# EAGLE design Cutman-RevA (EAGLE 6.5.0)
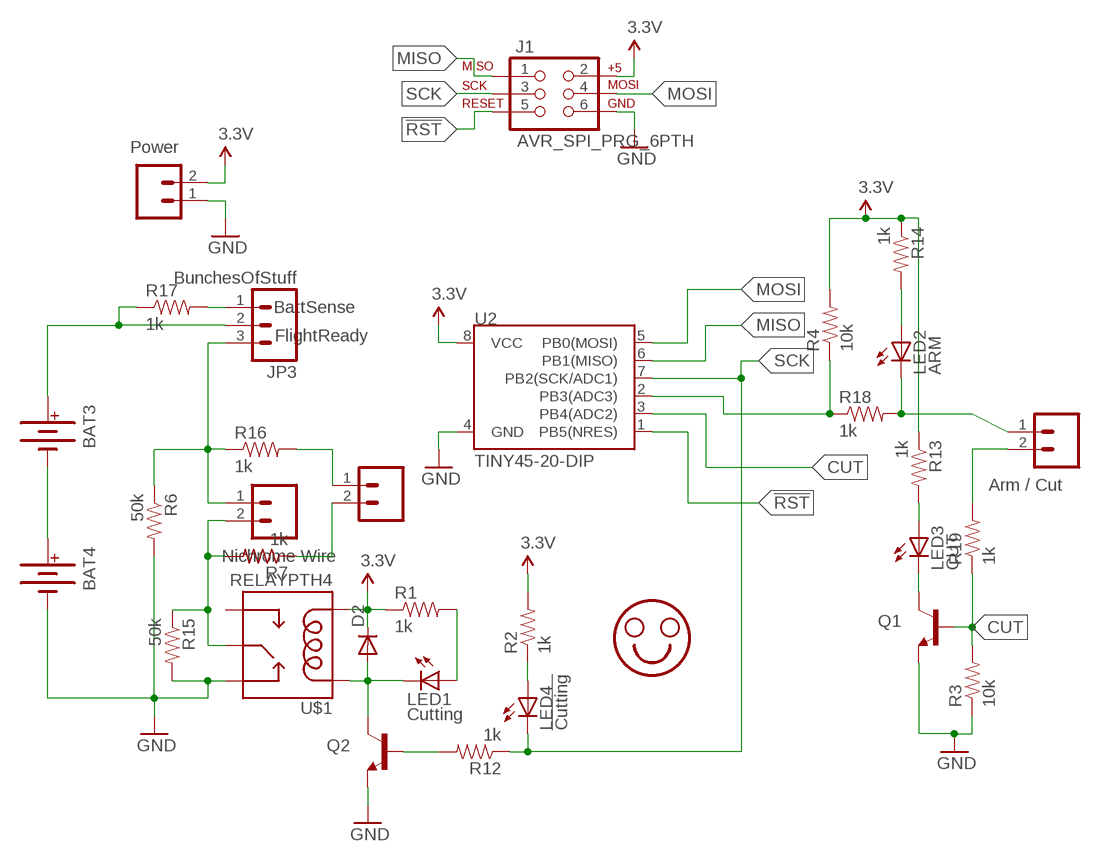
[diagram p0: schematic, sheet 1]

## Parts
BAT3  BATTERYAA-KIT  [BATTERY-AA-KIT]
BAT4  BATTERYAA-KIT  [BATTERY-AA-KIT]
D2  DIODEPTH  [DIODE-1N4001]
J1  AVR_SPI_PRG_6PTH  [2X3]
JP1  NichromeWire  M023.5MM_LOCK  [SCREWTERMINAL-3.5MM-2_LOCK]
JP2  Power  M023.5MM_LOCK  [SCREWTERMINAL-3.5MM-2_LOCK]
JP3  BunchesOfStuff  M03SCREW  [SCREWTERMINAL-3.5MM-3]
JP4  VSense  M023.5MM_LOCK  [SCREWTERMINAL-3.5MM-2_LOCK]
JP6  Arm/Cut  M023.5MM_LOCK  [SCREWTERMINAL-3.5MM-2_LOCK]
LED1  Cutting  LED5MM  [LED5MM]
LED2  ARM  LED5MM  [LED5MM]
LED3  CUT  LED5MM  [LED5MM]
LED4  !Cutting  LED5MM  [LED5MM]
Q1  TRANSISTOR_NPNTO92  [TO-92]
Q2  TRANSISTOR_NPNTO92  [TO-92]
R1  1k  RESISTORAXIAL-0.3  [AXIAL-0.3]
R2  1k  RESISTORAXIAL-0.3  [AXIAL-0.3]
R3  10k  RESISTORAXIAL-0.3  [AXIAL-0.3]
R4  10k  RESISTORAXIAL-0.3  [AXIAL-0.3]
R6  50k  RESISTORAXIAL-0.3  [AXIAL-0.3]
R7  1k  R-US_0309/V  [0309V]
R12  1k  RESISTORAXIAL-0.3  [AXIAL-0.3]
R13  1k  RESISTORAXIAL-0.3  [AXIAL-0.3]
R14  1k  RESISTORAXIAL-0.3  [AXIAL-0.3]
R15  50k  RESISTORAXIAL-0.3  [AXIAL-0.3]
R16  1k  RESISTORAXIAL-0.3  [AXIAL-0.3]
R17  1k  RESISTORAXIAL-0.3  [AXIAL-0.3]
R18  1k  RESISTORAXIAL-0.3  [AXIAL-0.3]
R19  1k  RESISTORAXIAL-0.3  [AXIAL-0.3]
STANDOFF1  STAND-OFF  [STAND-OFF]
STANDOFF2  STAND-OFF  [STAND-OFF]
U2  TINY45-20-DIP  ATTINY45TINY45-20-DIP  [DIP08]
U$1  RELAYPTH4  [RELAY-JZC]

## Nets
3.3V: D2.C J1.2 JP2.2 R1.P$1 R2.P$2 R4.P$2 R13.P$1 R14.P$1 U2.8(VCC) U$1.1(COIL2)
!RST: J1.5 U2.1(PB5(NRES))
ARM: R4.P$1 R18.P$1 U2.2(PB3(ADC3))
CUT: Q1.2(B) R3.P$2 R19.P$1 U2.3(PB4(ADC2))
GND: BAT4.GND@1(-) BAT4.GND@2(-) J1.6 JP2.1 Q1.1(E) Q2.1(E) R3.P$1 R6.P$2 R15.P$2 U2.4(GND) U$1.2(NC)
MISO: J1.1 U2.6(PB1(MISO))
MOSI: J1.4 U2.5(PB0(MOSI))
N$1: JP1.1 JP3.3 R6.P$1 R16.P$1
N$2: JP1.2 R7.2 R15.P$1 U$1.4(MAIN)
N$3: LED1.A R1.P$2
N$4: JP3.1 R17.P$2
N$5: BAT3.PWR@1(+) BAT3.PWR@2(+) JP3.2 R17.P$1
N$6: LED4.A R2.P$1
N$7: LED2.A R14.P$2
N$8: JP4.1 R16.P$2
N$9: JP6.1 LED2.K(C) R18.P$2
N$10: JP6.2 R19.P$2
N$11: BAT3.GND@1(-) BAT3.GND@2(-) BAT4.PWR@1(+) BAT4.PWR@2(+)
N$12: D2.A LED1.K(C) Q2.3(C) U$1.5(COIL1)
N$13: JP4.2 R7.1
N$14: LED3.K(C) Q1.3(C)
N$15: Q2.2(B) R12.P$2
N$16: LED3.A R13.P$2
SCK: J1.3 LED4.K(C) R12.P$1 U2.7(PB2(SCK/ADC1))
Unconnected: U$1.3(NO)

## Notes on the sheet
- Power
- BattSense
- FlightReady
- Arm / Cut
- Nichrome Wire

## Library data of the parts
BAT3 BAT4 = SparkFun-Electromechanical:BATTERY: Battery Holders Various common sizes : AA, AAA, 20mm coin cell and 12mm coin cell. 20MM_4LEGS, BATT-10373; PROD_ID: BATT-08316
D2 = SparkFun-DiscreteSemi:DIODE: Diode These are standard reverse protection diodes and small signal diodes. SMA package can handle up to about 1A. SOD-323 can handle about 200mA. What the SOD-323 package when ordering, there are some mfgs out there that are 5-pin packages.
J1 = SparkFun-Connectors:AVR_SPI_PRG_6: AVR ISP 6 Pin This is the reduced ISP connector for AVR programming. Common on Arduino. This footprint will take up less PCB space and can be used with a 10-pin to 6-pin adapter such as SKU: BOB-08508
JP1 JP2 JP4 JP6 = SparkFun-Connectors:M02: Standard 2-pin 0.1" header. Use with - straight break away headers ( PRT-00116) - right angle break away headers (PRT-00553) - swiss pins (PRT-00743) - machine pins (PRT-00117) - female headers (PRT-00115) Molex polarized connector foot print use with: PRT-08233 with associated crimp pins and housings. 2.54_SCREWTERM for use with PRT-10571. 3.5mm Screw Terminal footprints for PRT-08084 5mm Screw Terminal footprints for use with PRT-08433
JP3 = SparkFun-Connectors:M03: Header 3 Standard 3-pin 0.1" header. Use with straight break away headers (SKU : PRT-00116), right angle break away headers (PRT-00553), swiss pins (PRT-00743), machine pins (PRT-00117), and female headers (PRT-00115). Molex polarized connector foot print use with SKU : PRT-08232 with associated crimp pins and housings.
LED1-LED4 = adafruit:LED: LED OSRAM: - CHIPLED LG R971, LG N971, LY N971, LG Q971, LY Q971, LO R971, LY R971 LH N974, LH R974 LS Q976, LO Q976, LY Q976 LO Q996 - Hyper CHIPLED LW Q18S LB Q993, LB Q99A, LB R99A - SideLED LS A670, LO A670, LY A670, LG A670, LP A670 LB A673, LV A673, LT A673, LW A673 LH A674 LY A675 LS A676, LA A676, LO A676, LY A676, LW A676 LS A679, LY A679, LG A679 - Hyper Micro SIDELED® LS Y876, LA Y876, LO Y876, LY Y876 LT Y87S - SmartLED LW L88C, LW L88S LB L89C, LB L89S, LG L890 LS L89K, LO L89K, LY L89K LS L896, LA L896, LO L896, LY L896 - TOPLED LS T670, LO T670, LY T670, LG T670, LP T670 LSG T670, LSP T670, LSY T670, LOP T670, LYG T670 LG T671, LOG T671, LSG T671 LB T673, LV T673, LT T673, LW T673 LH T674 LS T676, LA T676, LO T676, LY T676, LB T676, LH T676, LSB T676, LW T676 LB T67C, LV T67C, LT T67C, LS T67K, LO T67K, LY T67K, LW E67C LS E67B, LA E67B, LO E67B, LY E67B, LB E67C, LV E67C, LT E67C LW T67C LS T679, LY T679, LG T679 LS T770, LO T770, LY T770, LG T770, LP T770 LB T773, LV T773, LT T773, LW T773 LH T774 LS E675, LA E675, LY E675, LS T675 LS T776, LA T776, LO T776, LY T776, LB T776 LHGB T686 LT T68C, LB T68C - Hyper Mini TOPLED® LB M676 - Mini TOPLED Santana® LG M470 LS M47K, LO M47K, LY M47K Source: http://www.osram.convergy.de/
Q1 Q2 = SparkFun-DiscreteSemi:TRANSISTOR_NPN: Generic NPN BJT MMBT2222A - TRANS-08049 (SOT-23, 1A 40V) MPSA42 - TRANS-09116 (SOT-23, 500mA 300V) MMBT5088LT1G - TRANS-11160 (SOT-23, 50 mA 30V)
R1-R4 R6 R12-R19 = SparkFun-Passives:RESISTOR: Resistor Basic schematic elements and footprints for 0603, 1206, and PTH resistors.
R7 = resistor:R-US_: RESISTOR, American symbol
STANDOFF1 STANDOFF2 = SparkFun-Electromechanical:STAND-OFF: #4 Stand Off This is the mechanical footprint for a #4 phillips button head screw. Use the keepout ring to avoid running the screw head into surrounding components. SKU : PRT-00447
U2 = SparkFun-DigitalIC:ATTINY45: Atmel 8-pin 2/4/8kB flash uC; PROD_ID: IC-09439
U$1 = SparkFun-Electromechanical:RELAY: SPDT relay (COM-00101)

## Net classes
1 vcc: width 0.254 mm, drill 0.254 mm, clearance 0.254 mm

## Board
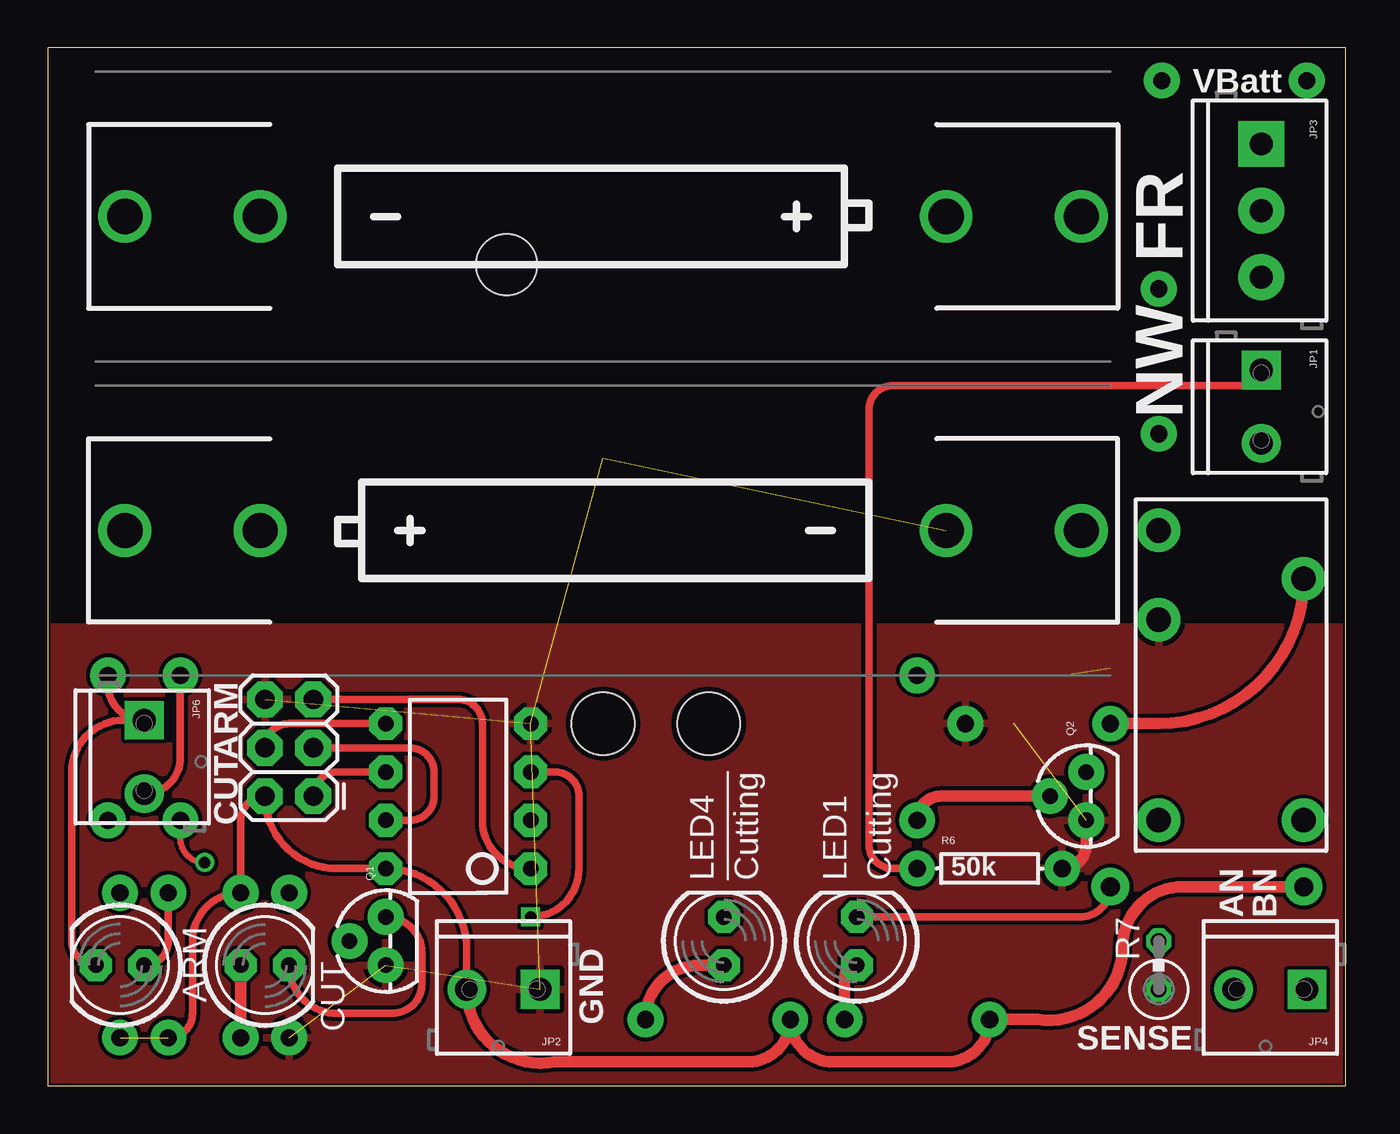
[diagram p1: board, top side]
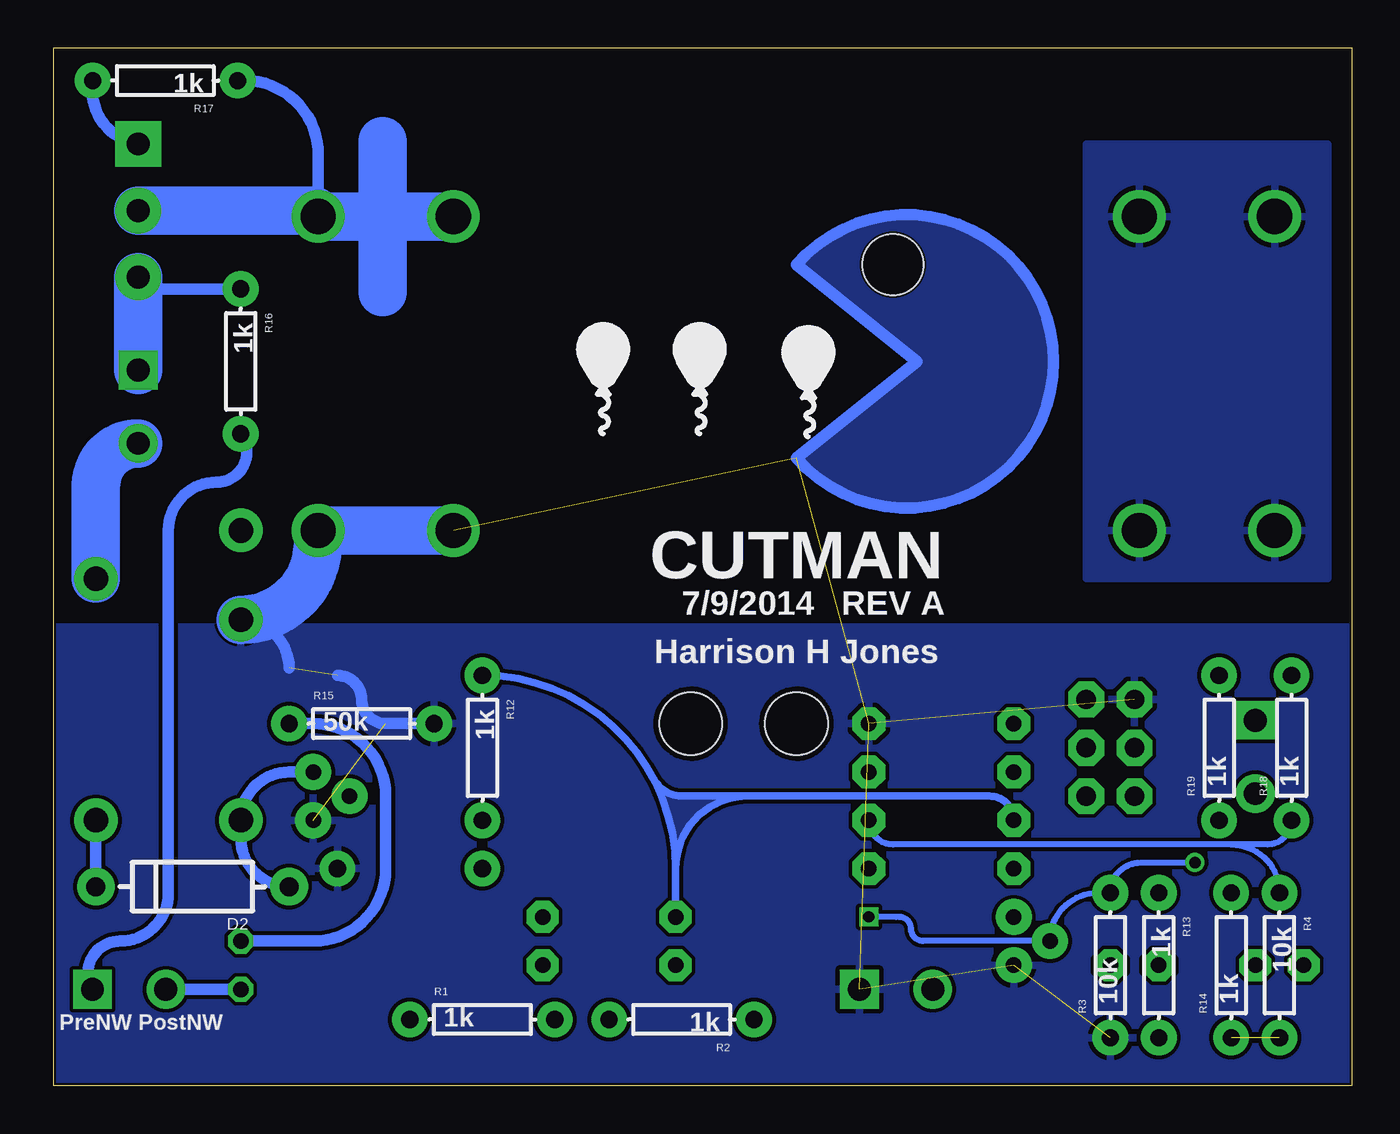
[diagram p2: board, bottom side, seen from below]

Size 68.25 x 54.6 mm. Coordinates in mm from the lower left corner, seen from the top.
Outline: 0,0 68.25,0 68.25,54.6 0,54.6 0,0
Copper layers (1*16): Top 0.035mm / dielectric 1.5mm / Bottom 0.035mm
Design rules "default *": minimum track width 10mil, minimum drill 0.6mm, track to track 8mil, track to pad 8mil, pad to pad 8mil, via to via 8mil, smd to smd 8mil, copper to edge 5mil, drill to drill 8mil, minimum pad ring 10mil, minimum via ring 8mil, stop-mask expansion 4mil, vias tented up to drill 0mil, thermal gap 10mil
Holes 3.2 mm at 24.13,43.18
bRestrict: area 22.9,41.9 to 25.4,44.5

### Footprints (pad centres in the part's own frame; a part is rotated, then mirrored left to right if it is on the bottom)
BATTERY-AA-KIT = drill 1.854: GND@1 25.146,0; GND@2 18.034,0; PWR@1 -25.146,0; PWR@2 -18.034,0
DIODE-1N4001 = drill 1 pad 1.981: A -5.08,0; C 5.08,0
2X3 = drill 1.016 pad 1.88 octagon: 1 0,0; 2 0,2.54; 3 2.54,0; 4 2.54,2.54; 5 5.08,0; 6 5.08,2.54
SCREWTERMINAL-3.5MM-2_LOCK = drill 1.2 pad 2.032 square: 1 -0.178,0 | drill 1.2 pad 2.032: 2 3.678,0
SCREWTERMINAL-3.5MM-3 = drill 1.2 pad 2.413 square: 1 0,0 | drill 1.2 pad 2.413: 2 3.5,0; 3 7,0
LED5MM = drill 0.813 pad 1.676 octagon: A -1.27,0; K 1.27,0
TO-92 = drill 0.813 pad 1.88: 1 -1.27,0; 2 0,1.905; 3 1.27,0
AXIAL-0.3 = drill 0.9 pad 1.88: P$1 -3.81,0; P$2 3.81,0
0309V = drill 0.813 octagon: 1 -1.27,0; 2 1.27,0
STAND-OFF = hole 3.302: 0,0
DIP08 = drill 0.813 pad 1.727 octagon: 1 -3.81,-3.81; 2 -1.27,-3.81; 3 1.27,-3.81; 4 3.81,-3.81; 5 3.81,3.81; 6 1.27,3.81; 7 -1.27,3.81; 8 -3.81,3.81
RELAY-JZC = drill 1.3 pad 2.286: 1 3.81,-8.89; 2 -3.81,1.651; 3 -3.81,6.35; 4 3.81,3.81; 5 -3.81,-8.89

### Placement (x,y rotation side)
BAT3  29.21,45.72 180 top
BAT4  29.21,29.21 0 top
D2  60.96,10.48 180 bottom
J1  13.97,15.24 90 top
JP1  63.82,37.47 270 top
JP2  25.72,5.08 180 top
JP3  63.82,49.53 270 top
JP4  66.04,5.08 180 top
JP6  5.08,19.05 270 top
LED1  42.55,7.62 90 top
LED2  3.81,6.35 180 top
LED3  11.43,6.35 0 top
LED4  35.56,7.62 90 top
Q1  17.78,7.62 90 top
Q2  54.61,15.24 90 top
R1  45.72,3.49 0 bottom
R2  35.24,3.49 180 bottom
R3  12.7,6.35 90 bottom
R4  3.81,6.35 270 bottom
R6  49.53,11.43 0 top
R7  58.42,6.35 90 top
R12  45.72,17.78 270 bottom
R13  10.16,6.35 270 bottom
R14  6.35,6.35 90 bottom
R15  52.07,19.05 0 bottom
R16  58.42,38.1 270 bottom
R17  62.39,52.86 180 bottom
R18  3.17,17.78 90 bottom
R19  6.99,17.78 90 bottom
STANDOFF1  29.21,19.05 0 top
STANDOFF2  34.77,19.05 0 top
U2  21.59,15.24 90 top
U$1  62.23,22.86 0 top

### Tracks (layer width: path | path; a pad name or v marks a point on that pad's centre or on a via)
3.3V  (1 unrouted)
  Top 0.406: R14.P$1 arc90 7.62,3.81 7.62,5.08 7.62,7.62 arc-90 R13.P$1 10.16,13.97 arc-90 J1.2 arc90 15.24,11.43 U2.8 arc-90 22.04,7.17 JP2.2
  Top 0.61: D2.C 59.69,10.48 arc90 56.52,7.3 arc-99 52.07,3.49 R1.P$1 arc-90 47.31,1.27 41.91,1.27 41.27,1.27 arc-90 R2.P$2 arc-90 36.83,1.27 26.67,1.27 arc-101 JP2.2
  Bottom 0.61: U$1.1 D2.C
!RST
  Top 0.406: J1.5 21.59,20.32 arc-90 22.86,19.05 22.86,13.97 arc90 U2.1
ARM
  Bottom 0.305: 6.35,12.7 24.13,12.7 arc90 U2.2 | 6.35,12.7 arc90 R4.P$1 | R18.P$1 arc90 4.45,12.7 6.35,12.7
CUT  (via drill 0.6)
  Top 0.305: v8.26,11.75 arc-90 6.99,13.02 R19.P$1
  Top 0.406: U2.3 26.67,16.51 arc-90 27.94,15.24 27.94,11.43 arc-90 v25.4,8.89
  Bottom 0.305: v25.4,8.89 23.97,8.89 23.81,8.89 arc90 23.18,8.26 arc-90 22.54,7.62 Q1.2 arc90 13.34,10.16 R3.P$2 arc90 11.11,11.75 v8.26,11.75
GND  (8 unrouted)
  Top 0.61: R6.P$2 arc90 54.61,12.7 Q2.1
  Bottom 0.61: 55.88,21.97 arc-90 U$1.2 | 53.34,21.59 arc90 52.07,20.32 arc-90 50.8,19.05 R15.P$2 | 29.21,43.18 22.86,38.1 29.21,33.02 arc-278 29.21,43.18
  Bottom 2.54: U$1.2 arc-90 54.36,28.57 BAT4.GND@1 BAT4.GND@2
  pour Top: -1.27,24.13 71.12,24.13 71.12,-1.27 -1.27,-1.27
  pour Bottom: -2.54,24.13 69.85,24.13 69.85,-1.27 -2.54,-1.27
  pour Bottom: 22.86,38.1 29.21,33.02 25.72,30.8 21.27,30.8 18.1,32.7 16.19,36.2 15.88,38.1 16.51,41.27 18.41,43.81 21.27,45.4 24.13,45.72 26.67,45.09 29.21,43.18
MISO
  Top 0.406: U2.6 15.24,16.51 arc90 J1.1
MOSI
  Top 0.406: U2.5 12.7,19.05 arc90 J1.4
N$1
  Top 0.406: R6.P$1 44.45,11.43 arc-90 43.18,12.7 43.18,35.56 arc-90 44.45,36.83 63.01,36.83 arc90 JP1.1
  Bottom 0.61: JP3.3 arc-90 63.2,41.91 R16.P$1
  Bottom 2.54: JP3.3 JP1.1
N$2
  Top 0.61: R15.P$1 58.42,19.05 arc90 U$1.4
  Bottom 0.61: R15.P$1 54.61,19.05 arc90 50.8,15.24 50.8,11.43 arc90 54.61,7.62 R7.2
  Bottom 2.54: JP1.2 arc-90 66.04,31.57 U$1.4
N$3
  Top 0.61: LED1.A arc90 41.91,5.71 R1.P$2
N$4
  Bottom 0.61: R17.P$2 arc-90 JP3.1
N$5
  Bottom 0.61: R17.P$1 arc90 54.36,49.28 BAT3.PWR@1
  Bottom 2.54: JP3.2 54.67,46.03 arc90 BAT3.PWR@1 BAT3.PWR@2
N$6
  Top 0.61: R2.P$1 arc-90 34.29,6.35 LED4.A
N$7
  Top 0.406: R14.P$2 6.35,7.62 arc-90 LED2.A
N$8
  Bottom 0.61: JP4.1 arc121 64.77,7.62 arc-90 62.23,10.16 62.23,12.7 62.23,29.21 arc90 59.69,31.75 arc-127 R16.P$2
N$9
  Top 0.406: LED2.K arc-90 1.27,7.62 1.27,16.51 arc-90 3.99,19.23 JP6.1 arc-90 3.17,21.13 R18.P$2
N$10
  Top 0.406: R19.P$2 6.99,17.28 arc-90 JP6.2
N$11
  pour Bottom: 1.27,49.53 13.97,49.53 13.97,26.67 1.27,26.67
N$12
  Top 0.406: LED1.K 54.29,8.89 arc90 D2.A
  Bottom 0.61: D2.A arc90 58.42,13.02 U$1.5 arc90 55.88,16.51 Q2.3
N$13
  Bottom 0.61: JP4.2 R7.1
N$14
  Top 0.406: Q1.3 arc-90 19.68,6.99 19.68,5.4 arc-90 18.1,3.81 17.78,3.81 15.24,3.81 arc-90 LED3.K
N$15
  Top 0.61: R12.P$2 arc-90 46.99,15.24 Q2.2
N$16
  Top 0.61: R13.P$2 LED3.A
N$17
  Bottom 2.54: 50.96,49.69 50.96,41.75
SCK
  Top 0.406: J1.3 19.05,17.78 arc-90 20.32,16.51 20.32,15.24 arc-90 19.05,13.97 U2.7
  Bottom 0.406: R12.P$1 arc90 35.56,11.43 | 35.56,11.43 LED4.K | 35.56,11.43 arc90 31.75,15.24 | 31.75,15.24 27.94,15.24 19.05,15.24 arc90 U2.7 | 31.75,15.24 35.24,15.24 arc53 36.51,15.88
  pour Bottom: 33.02,15.24 34.61,14.29 arc-44 35.56,13.02 36.2,15.24

### Text on the board
tPlace: VBatt | FR | NW | ARM | CUT | AN | BN | GND | SENSE
bPlace: CUTMAN | REV A | 7/9/2014 | Harrison H Jones | PreNW PostNW